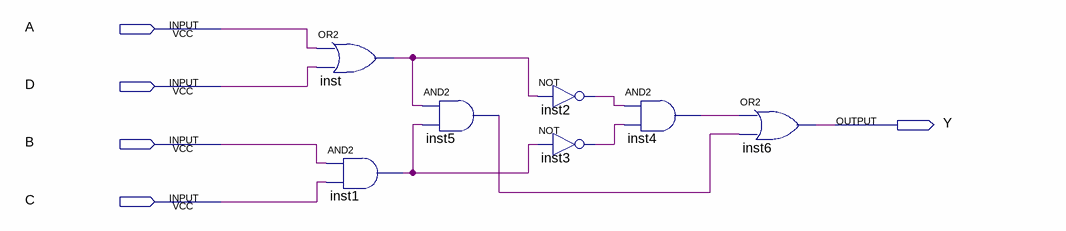
[diagram p0: schematic sheet]
// Quartus schematic lab11.bdf as structural Verilog: 7 symbols, 5 pins
module lab11 (
  input  A,
  input  D,
  input  B,
  input  C,
  output Y
);

  wire inst1_out, inst2_out, inst3_out, inst4_out, inst5_out, inst_out;

  or inst (inst_out, A, D);
  and inst1 (inst1_out, B, C);
  and inst5 (inst5_out, inst_out, inst1_out);
  not inst2 (inst2_out, inst_out);
  not inst3 (inst3_out, inst1_out);
  and inst4 (inst4_out, inst2_out, inst3_out);
  or inst6 (Y, inst4_out, inst5_out);
endmodule
